# EasyEDA Pro project fan.eprj

# Schematic Schematic1
Create Date: 2022-11-01; Page Name: P1; Project Name: fan; Schematic Name: Schematic1; Update Date: 2022-11-12; Company: 嘉立创EDA; Page Size: A4; Version: V1.0
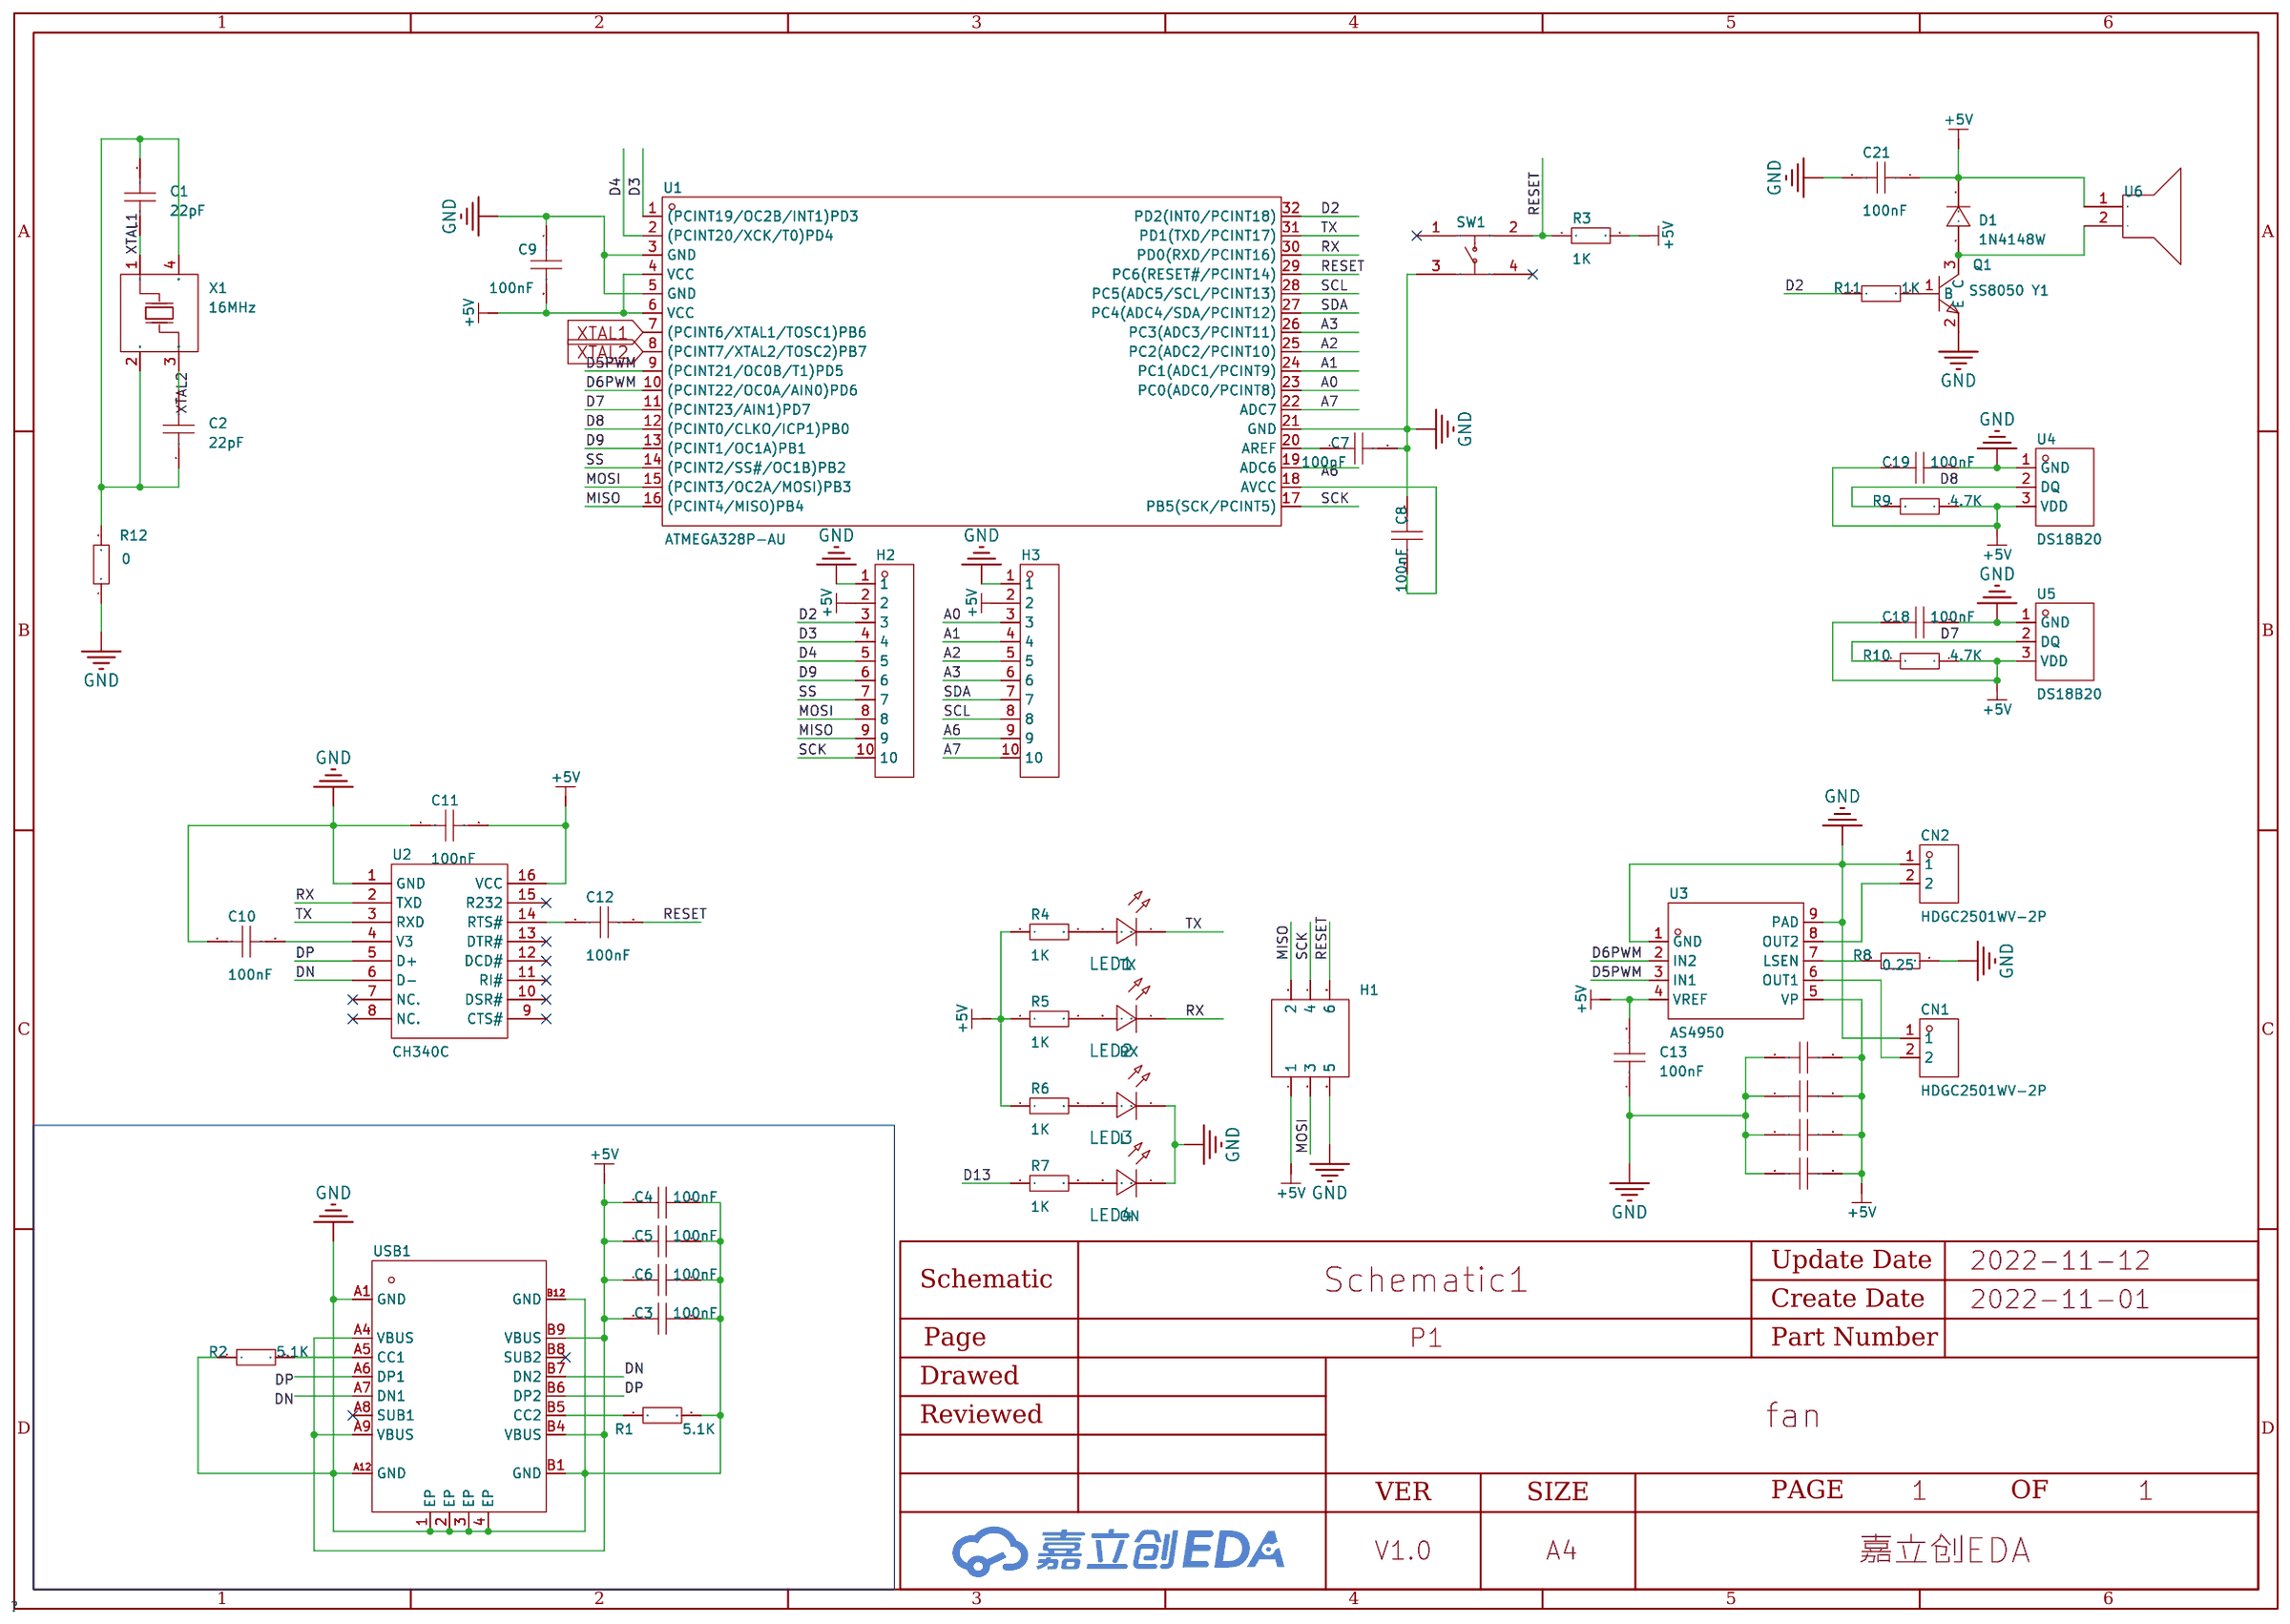
[diagram p0: schematic sheet]

## Parts
C1  100nF  [C0603]
C2  100nF  [C0603]
C3  100nF  [C0603]
C4  100nF  [C0603]
C5  100nF  [C0603]
C6  100nF  [C0603]
C7  100nF  [C0603]
C8  100nF  [C0603]
C9  100nF  [C0603]
C10  100nF  [C0603]
C11  100nF  [C0603]
C12  100nF  [C0603]
C13  100nF  [C0603]
C14  100nF  [C0603]
C15  100nF  [C0603]
C16  100nF  [C0603]
C17  100nF  [C0603]
C18  100nF  [C0603]
C19  100nF  [C0603]
C21  100nF  [C0603]
CN1  HDGC2501WV-2P  [CONN-TH_XH2.5-2P]
CN2  HDGC2501WV-2P  [CONN-TH_XH2.5-2P]
D1  1N4148W  [SOD-123_L2.8-W1.8-LS3.7-RD]
H1  -  [HDR-TH_6P-P2.54-V-R2-C3-S2.54_A2541WV-2X3P]
H2  -  [HDR-TH_10P-P2.54-V-F]
H3  -  [HDR-TH_10P-P2.54-V-F]
LED1  TX  [LED0603-RD_BLUE]
LED2  RX  [LED0603-RD_BLUE]
LED3  L  [LED0603-RD_BLUE]
LED4  ON  [LED0603-RD_BLUE]
Q1  SS8050 Y1  [SOT-23-3_L2.9-W1.3-P1.90-LS2.4-BR]
R1  10K  [R0603]
R2  10K  [R0603]
R3  10K  [R0603]
R4  10K  [R0603]
R5  10K  [R0603]
R6  10K  [R0603]
R7  10K  [R0603]
R8  10K  [R0603]
R9  10K  [R0603]
R10  10K  [R0603]
R11  10K  [R0603]
R12  10K  [R0603]
SW1  TSC015A03518A  [KEY-SMD_4P-L4.5-W4.5-P3.00-LS6.9]
U1  ATMEGA328P-AU  [TQFP-32_L7.0-W7.0-P0.80-LS9.0-BL]
U2  CH340C  [SOP-16_L10.0-W3.9-P1.27-LS6.0-BL]
U3  AS4950  [ESOP-8_L4.9-W3.9-P1.27-LS6.0-BL-EP]
U4  DS18B20  [TO-92-3_L4.9-W3.7-P1.27-L]
U5  DS18B20  [TO-92-3_L4.9-W3.7-P1.27-L]
U6  SFN-1270-0540-35P5.0  [BUZ-TH_BD12.5-P5.00-D0.9]
USB1  -  [USB-C-SMD_KH-TYPE-C-16P]
X1  16MHz  [CRYSTAL-SMD_4P-L3.2-W2.5-BL]

## Library data of the parts
C1-C19 C21 = CAP_0603: Supplier Footprint: 0603
CN1 CN2 = HDGC2501WV-2P: LCSC Part Name: XH2.5直针 2P; Supplier Part: C5175248; Manufacturer: HDGC(华德共创); Supplier Footprint: 直插,P=2.5mm; JLCPCB Part Class: Extended Part; Datasheet: https://atta.szlcsc.com/upload/public/pdf/source/20220916/EBD9616D8472D4916EA8DD7ED7929FB0.pdf; Supplier: LCSC
D1 = 1N4148W_C2099: 二极管配置:独立式;功率:500mW;直流反向耐压(Vr):100V;平均整流电流(Io):150mA;正向压降(Vf):1.25V@150mA;反向电流(Ir):1A@75V;反向恢复时间(trr):4ns;工作温度:+150@(Tj);; LCSC Part Name: 100V 150mA 4ns T4; Supplier Part: C2099; Manufacturer: CJ（江苏长电/长晶）; Supplier Footprint: SOD-123; JLCPCB Part Class: Extended Part; Datasheet: https://atta.szlcsc.com/upload/public/pdf/source/20120428/1457706480199.pdf; Supplier: LCSC; Diode Configuration: 独立式; Power Dissipation: 500mW; Reverse Voltage (Vr): 100V; Average Rectified Current (Io): 150mA; Forward Voltage (Vf@If): 1.25V@150mA; Reverse Leakage Current: 1A@75V; Reverse Recovery Time (trr): 4ns; Operating Temperature: +150@(Tj)
H1 = HDR-M_2.54_2x3: Supplier Part: C402781; Supplier Footprint: 插件,P=2.54mm
H2 H3 = HDR-F_2.54_1x10P: Supplier Part: C2684744; Supplier Footprint: 插件
LED1-LED4 = LED_0603-R: 发光颜色:红灯;二极管配置:-;透镜颜色:无色透明;主波长:617.5nm;峰值波长:632nm;色温:-;光通量(25时):-;测试电流:5mA;正向电压(VF):2.2V;发光强度:28.5mcd;功率:60mW;发光角度:120°;安装方式:-;工作温度:-40~+85;; Supplier Footprint: 0603; Supplier Part: C72044
Q1 = SS8050 Y1: LCSC Part Name: SS8050; Supplier Part: C2926167; Manufacturer: FOSAN(富信); Supplier Footprint: SOT-23; JLCPCB Part Class: Extended Part; Datasheet: https://atta.szlcsc.com/upload/public/pdf/source/20211203/A2FBB7B594BDA3797EAA8BDF93CA780E.pdf; Supplier: LCSC
R1-R12 = Res_0603: Supplier Footprint: 0603
SW1 = TSC015A03518A: 触点电流:50mA;额定电压(AC):12V;额定电压(DC):12V;安装方式:立贴;按钮形状:圆形按钮;开关长度:4.5mm;开关宽度:4.5mm;开关高度:3.5mm;; LCSC Part Name: 4.5*4.5*3.5H-JT 180gf; Supplier Part: C2888502; Manufacturer: BZCN(博众电气); Supplier Footprint: SMD; JLCPCB Part Class: Extended Part; Datasheet: https://atta.szlcsc.com/upload/public/pdf/source/20210826/40F8757B55672B65C18B583168747780.pdf; Supplier: LCSC; Contact Current: 50mA; Voltage Rating (AC): 12V; Voltage Rating (DC): 12V; Mounting Style: 立贴; Actuator Style: 圆形按钮; Switch Length: 4.5mm; Switch Width: 4.5mm; Switch Height: 3.5mm
U1 = ATMEGA328P-AU: ATmega Series 20 MHz 32 KB Flash 2 KB SRAM 8-Bit Microcontroller - TQFP-32; Supplier Part: C14877; Manufacturer: MICROCHIP(美国微芯); Supplier Footprint: TQFP-32_7x7x08P; JLCPCB Part Class: Basic Part; Datasheet: https://atta.szlcsc.com/upload/public/pdf/source/20140621/1457707095197.pdf; Supplier: LCSC
U2 = CH340C: 类型:Transceiver;协议类别:USB 2.0;驱动器/接收器数:-;数据速率:2Mbps;; Supplier Part: C84681; Manufacturer: WCH(南京沁恒); Supplier Footprint: SOP-16_150mil; JLCPCB Part Class: Extended Part; Datasheet: https://atta.szlcsc.com/upload/public/pdf/source/20200819/C84681_ADBED554CE321879DBD6B1D06488689C.pdf; Supplier: LCSC; Type: Transceiver; Protocol: USB 2.0; Data Rate: 2Mbps; Supply Voltage: 3.3V, 5V
U3 = AS4950: 全桥DMOS有刷直流电机驱动器，3.5A峰值驱动输出，8V-40V宽电压供电，支持过流/短路/欠压/过温保护; Supplier Part: C2929412; Manufacturer: ASSEMSTAR(聚迹); Supplier Footprint: SOP-8PP; JLCPCB Part Class: Extended Part; Datasheet: https://atta.szlcsc.com/upload/public/pdf/source/20211206/0EDB9C15312BCF5F7B0263298AF906FD.pdf; Supplier: LCSC
U4 U5 = DS18B20: 传感器类型:-;输出类型:-;局部感温:-;远程感温:-;分辨率:-;; Supplier Part: C376006; Manufacturer: UMW(友台半导体); Supplier Footprint: TO-92; JLCPCB Part Class: Extended Part; Datasheet: https://atta.szlcsc.com/upload/public/pdf/source/20220307/F147739DAED5754340FA7BABB64A1D8C.pdf; Supplier: LCSC
U6 = SFN-1270-0540-35P5.0: 驱动方式：无源(外部驱动) 构造类型：压电式 额定电压：5V 频率：4000Hz 声压(SPL)：80dB@5V,10cm 直径(φD)：12.6mm 高度：7.5mm; Supplier Part: C3015481; Manufacturer: S&S(海旭); Supplier Footprint: 插件,P=5mm; JLCPCB Part Class: Extended Part; Datasheet: https://atta.szlcsc.com/upload/public/pdf/source/20220517/E2F404692071743447D3DA4216E14D26.pdf; Supplier: LCSC
USB1 = USB_TYPE-C-16P: 连接器类型:Type-C;标准:-;公母:母座;触点数量:16;端口数量:1;安装方式:卧贴;额定电流 - 电源:3A;工作温度范围:-40~+85;; Supplier Part: C709357; Supplier Footprint: 插件
X1 = TAXM16M4RFBCCT2T: 晶振类型:SMD 谐振器;频率:16MHz;频率公差:±10ppm;频率稳定度:±50ppm;负载电容:12pF;等效串联电阻(ESR):80Ω;工作温度:-;; LCSC Part Name: 16MHz ±10ppm 12pF; Supplier Part: C133336; Manufacturer: TAE(雅晶鑫); Supplier Footprint: SMD3225-4P; JLCPCB Part Class: Extended Part; Datasheet: https://atta.szlcsc.com/upload/public/pdf/source/20171014/C133336_15079754975751038233.pdf; Supplier: LCSC; Crystal Type: SMD 谐振器; Frequency Tolerance: ±10ppm; Frequency Stability: ±50ppm; Load Capacitance: 12pF; Equivalent Series Resistance (ESR): 80Ω

## Nets
+5V: C3.1 C4.1 C5.1 C6.1 C9.2 C11.2 C13.2 C14.2 C15.2 C16.2 C17.2 C18.1 C19.1 C21.1 D1.1(K) H1.1 H2.2 H3.2 R3.2 R4.1 R5.1 R6.1 R9.1 R10.1 U1.4(VCC) U1.6(VCC) U2.16(VCC) U3.4(VREF) U3.5(VP) U4.3(VDD) U5.3(VDD) U6.1(+) USB1.A4(VBUS) USB1.A9(VBUS) USB1.B4(VBUS) USB1.B9(VBUS)
GND: C3.2 C4.2 C5.2 C6.2 C7.2 C8.2 C9.1 C10.1 C11.1 C13.1 C14.1 C15.1 C16.1 C17.1 C18.2 C19.2 C21.2 CN1.1 CN2.1 H1.5 H2.1 H3.1 LED3.1(C) LED4.1(C) Q1.2(E) R1.2 R2.1 R8.2 R12.1 SW1.3 U1.3(GND) U1.5(GND) U1.21(GND) U2.1(GND) U3.1(GND) U3.9(PAD) U4.1(GND) U5.1(GND) USB1.1(EP) USB1.2(EP) USB1.3(EP) USB1.4(EP) USB1.A1(GND) USB1.A12(GND) USB1.B1(GND) USB1.B12(GND)
A0: H3.3 U1.23(PC0(ADC0/PCINT8))
A1: H3.4 U1.24(PC1(ADC1/PCINT9))
A2: H3.5 U1.25(PC2(ADC2/PCINT10))
A3: H3.6 U1.26(PC3(ADC3/PCINT11))
A6: H3.9 U1.19(ADC6)
A7: H3.10 U1.22(ADC7)
D2: H2.3 R11.1 U1.32(PD2(INT0/PCINT18))
D3: H2.4 U1.1((PCINT19/OC2B/INT1)PD3)
D4: H2.5 U1.2((PCINT20/XCK/T0)PD4)
D5PWM: U1.9((PCINT21/OC0B/T1)PD5) U3.3(IN1)
D6PWM: U1.10((PCINT22/OC0A/AIN0)PD6) U3.2(IN2)
D7: R10.2 U1.11((PCINT23/AIN1)PD7) U5.2(DQ)
D8: R9.2 U1.12((PCINT0/CLKO/ICP1)PB0) U4.2(DQ)
D9: H2.6 U1.13((PCINT1/OC1A)PB1)
D13: R7.1
DN: U2.6(D-) USB1.A7(DN1) USB1.B7(DN2)
DP: U2.5(D+) USB1.A6(DP1) USB1.B6(DP2)
MISO: H1.2 H2.9 U1.16((PCINT4/MISO)PB4)
MOSI: H1.3 H2.8 U1.15((PCINT3/OC2A/MOSI)PB3)
RESET: C12.2 H1.6 R3.1 SW1.2 U1.29(PC6(RESET#/PCINT14))
RX: LED2.1(C) U1.30(PD0(RXD/PCINT16)) U2.2(TXD)
SCK: H1.4 H2.10 U1.17(PB5(SCK/PCINT5))
SCL: H3.8 U1.28(PC5(ADC5/SCL/PCINT13))
SDA: H3.7 U1.27(PC4(ADC4/SDA/PCINT12))
SS: H2.7 U1.14((PCINT2/SS#/OC1B)PB2)
TX: LED1.1(C) U1.31(PD1(TXD/PCINT17)) U2.3(RXD)
XTAL1: C1.1 U1.7((PCINT6/XTAL1/TOSC1)PB6) X1.1(OSC1)
XTAL2: C2.2 U1.8((PCINT7/XTAL2/TOSC2)PB7) X1.3(OSC2)
$1N27022: R2.2 USB1.A5(CC1)
$1N27208: R1.1 USB1.B5(CC2)
$1N32019: C7.1 U1.20(AREF)
$1N33833: C8.1 U1.18(AVCC)
$1N34726: C10.2 U2.4(V3)
$1N34859: C12.1 U2.14(RTS#)
$1N36273: LED1.2(A) R4.2
$1N36377: LED2.2(A) R5.2
$1N36480: LED3.2(A) R6.2
$1N36586: LED4.2(A) R7.2
$1N40110: R8.1 U3.7(LSEN)
$1N40463: CN2.2 U3.8(OUT2)
$1N40537: CN1.2 U3.6(OUT1)
$1N50250: D1.2(A) Q1.3(C) U6.2(-)
$1N50740: Q1.1(B) R11.2
$1N54622: C1.2 C2.1 R12.2 X1.2(GND) X1.4(GND)

Not connected (* = marked no-connect by the designer): SW1 1* 4*; U2 7(NC.)* 8(NC.)* 9(CTS#)* 10(DSR#)* 11(RI#)* 12(DCD#)* 13(DTR#)* 15(R232)*; USB1 A8(SUB1)* B8(SUB2)*

# Board PCB1
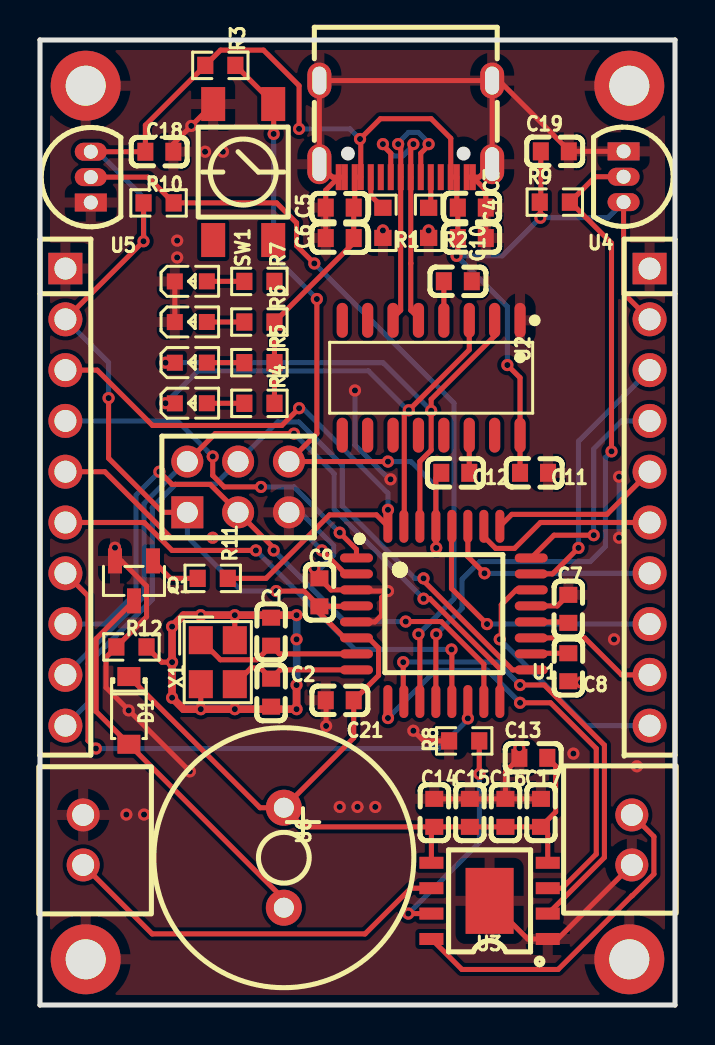
[diagram p1: board, top side]
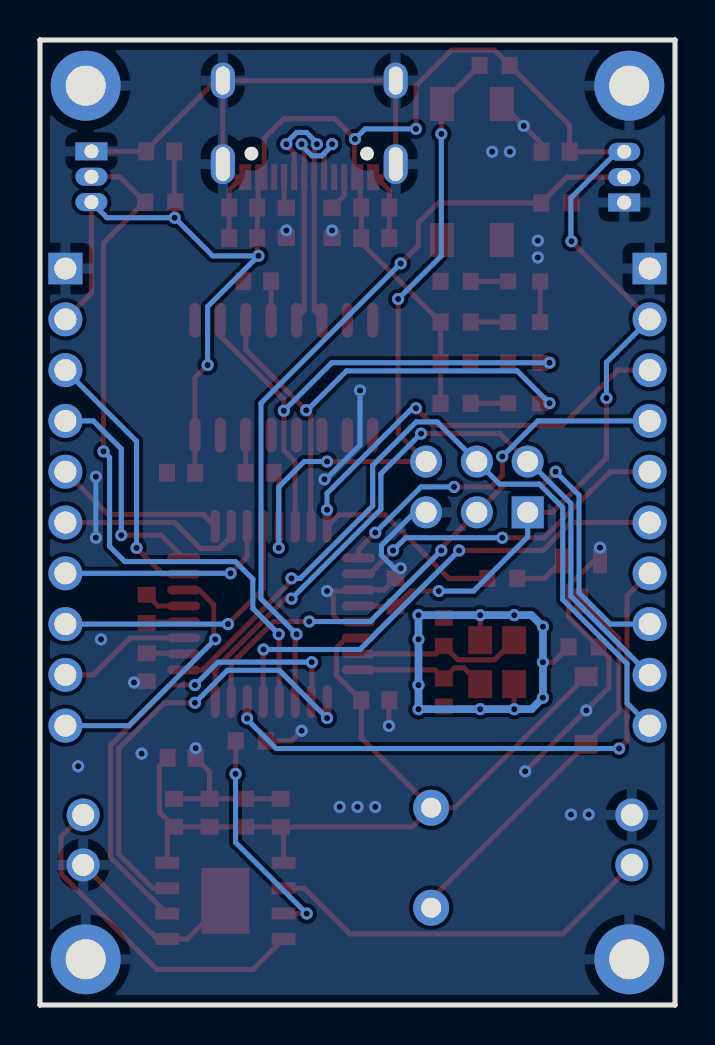
[diagram p2: board, bottom side, seen from below]

Outline 31.75 x 48.26 mm; copper layers: Top Layer, Bottom Layer. Coordinates in mm from the lower left corner of the outline.
Outline path: 0,48.26 0,0 arc(0,0) 0,0 31.75,0 arc(31.75,0) 31.75,0 31.75,48.26 arc(31.75,48.26) 31.75,48.26 0,48.26 arc(0,48.26) 0,48.26
Stack: Top Layer 0.035mm / Dielectric1 1.51mm FR4 er 4.5 / Bottom Layer 0.035mm

## Design rules (mm)
net TX: DP1
net RX: DP1
net MISO: DP3
net SCK: DP3
net SCL: DP4
net SDA: DP4
net A3: DP5
net A2: DP5
net D6PWM: DP2
net D5PWM: DP2
net D4: DP6
net D3: DP6
spacing safeClearance (default): track to track 0.152, other pairs 0.152 to 0.3
track width trackWidth (default): min 0.127, default 0.254, max 2.54
differential pair differentialPair (default): width min 0.127, default 0.254, max 2.54; gap min 0.152, default 0.152
via viaSize (default): diameter min 0.5, default 0.61, max 10; hole min 0.3, default 0.305, max 6

## Placement (name value [footprint] x y rotation side)
C1  100nF  [C0603]  11.56 18.67 90 top
C2  100nF  [C0603]  11.56 15.62 90 top
C3  100nF  [C0603]  21.59 39.88 0 top
C4  100nF  [C0603]  21.59 38.35 0 top
C5  100nF  [C0603]  14.99 39.88 180 top
C6  100nF  [C0603]  14.99 38.35 180 top
C7  100nF  [C0603]  26.42 19.81 90 top
C8  100nF  [C0603]  26.42 16.89 270 top
C9  100nF  [C0603]  13.97 20.64 270 top
C10  100nF  [C0603]  20.89 36.19 180 top
C11  100nF  [C0603]  24.7 26.61 180 top
C12  100nF  [C0603]  20.76 26.61 180 top
C13  100nF  [C0603]  24.67 12.36 0 top
C14  100nF  [C0603]  19.71 9.61 270 top
C15  100nF  [C0603]  21.49 9.61 270 top
C16  100nF  [C0603]  23.27 9.61 270 top
C17  100nF  [C0603]  25.05 9.61 270 top
C18  100nF  [C0603]  5.97 42.67 0 top
C19  100nF  [C0603]  25.74 42.69 0 top
C21  100nF  [C0603]  14.99 15.24 180 top
CN1  HDGC2501WV-2P  [CONN-TH_XH2.5-2P]  2.16 8.25 270 top
CN2  HDGC2501WV-2P  [CONN-TH_XH2.5-2P]  29.59 8.25 90 top
D1  1N4148W  [SOD-123_L2.8-W1.8-LS3.7-RD]  4.44 14.73 270 top
H1  -  [HDR-TH_6P-P2.54-V-R2-C3-S2.54_A2541WV-2X3P]  9.91 25.91 0 top
H2  -  [HDR-TH_10P-P2.54-V-F]  1.27 25.4 270 top
H3  -  [HDR-TH_10P-P2.54-V-F]  30.48 25.4 270 top
LED1  TX  [LED0603-RD_BLUE]  7.54 30.09 0 top
LED2  RX  [LED0603-RD_BLUE]  7.54 32.12 0 top
LED3  L  [LED0603-RD_BLUE]  7.54 34.15 0 top
LED4  ON  [LED0603-RD_BLUE]  7.54 36.19 0 top
NOREF  -  [Pad_e6]  2.29 45.97 0 top
NOREF#2  -  [Pad_e10]  29.46 45.97 0 top
NOREF#3  -  [Pad_e11]  2.29 2.29 0 top
NOREF#4  -  [Pad_e12]  29.46 2.29 0 top
Q1  SS8050 Y1  [SOT-23-3_L2.9-W1.3-P1.90-LS2.4-BR]  4.7 21.21 90 top
R1  10K  [R0603]  17.15 39.12 270 top
R2  10K  [R0603]  19.43 39.12 90 top
R3  10K  [R0603]  9.02 46.99 180 top
R4  10K  [R0603]  10.97 30.09 180 top
R5  10K  [R0603]  10.97 32.12 180 top
R6  10K  [R0603]  10.97 34.15 180 top
R7  10K  [R0603]  10.97 36.19 180 top
R8  10K  [R0603]  21.21 13.21 180 top
R9  10K  [R0603]  25.74 40.15 0 top
R10  10K  [R0603]  5.93 40.11 0 top
R11  10K  [R0603]  8.64 21.34 180 top
R12  10K  [R0603]  4.57 17.91 0 top
SW1  TSC015A03518A  [KEY-SMD_4P-L4.5-W4.5-P3.00-LS6.9]  10.16 41.66 90 top
U1  ATMEGA328P-AU  [TQFP-32_L7.0-W7.0-P0.80-LS9.0-BL]  20.19 19.56 270 top
U2  CH340C  [SOP-16_L10.0-W3.9-P1.27-LS6.0-BL]  19.56 31.37 180 top
U3  AS4950  [ESOP-8_L4.9-W3.9-P1.27-LS6.0-BL-EP]  22.48 5.21 90 top
U4  DS18B20  [TO-92-3_L4.9-W3.7-P1.27-L]  29.18 41.42 270 top
U5  DS18B20  [TO-92-3_L4.9-W3.7-P1.27-L]  2.54 41.4 90 top
U6  SFN-1270-0540-35P5.0  [BUZ-TH_BD12.5-P5.00-D0.9]  12.19 7.37 270 top
USB1  -  [USB-C-SMD_KH-TYPE-C-16P]  18.29 43.81 180 top
X1  16MHz  [CRYSTAL-SMD_4P-L3.2-W2.5-BL]  8.89 17.14 270 top

## Footprints (pads in the part's own frame, mm; a bottom-side part is the same pattern mirrored in y, then rotated)
BUZ-TH_BD12.5-P5.00-D0.9
  round 1.8 hole 1: 1(-2.5,0) 2(2.5,0)
C0603
  rect 0.8x0.9 smd: 1(-0.7,0) 2(0.7,0)
CONN-TH_XH2.5-2P
  round 1.65 hole 1.1: 1(-1.25,0) 2(1.25,0)
CRYSTAL-SMD_4P-L3.2-W2.5-BL
  rect 1.4x1.2 smd: 1(-1.1,-0.85) 2(1.1,-0.85) 3(1.1,0.85) 4(-1.1,0.85)
ESOP-8_L4.9-W3.9-P1.27-LS6.0-BL-EP
  rect 0.6x1.2 smd: 1(-1.905,-2.909) 2(-0.635,-2.909) 3(0.635,-2.909) 4(1.905,-2.909) 5(1.905,2.909) 6(0.635,2.909) 7(-0.635,2.909) 8(-1.905,2.909)
  rect 3.3x2.4 smd: 9(0,0)
HDR-TH_6P-P2.54-V-R2-C3-S2.54_A2541WV-2X3P
  rect 1.6x1.6 hole 1.05: 1(-2.54,-1.27)
  round 1.6 hole 1.05: 2(-2.54,1.27) 3(0,-1.27) 4(0,1.27) 5(2.54,-1.27) 6(2.54,1.27)
HDR-TH_10P-P2.54-V-F
  rect 1.575x1.7 hole 1.1: 1(-11.43,0)
  round 1.7 hole 1.1: 2(-8.89,0) 3(-6.35,0) 4(-3.81,0) 5(-1.27,0) 6(1.27,0) 7(3.81,0) 8(6.35,0) 9(8.89,0) 10(11.43,0)
KEY-SMD_4P-L4.5-W4.5-P3.00-LS6.9
  rect 1.7x1.199 smd: 1(-3.401,-1.501) 2(3.401,-1.501) 3(3.401,1.501) 4(-3.401,1.501)
LED0603-RD_BLUE
  rect 0.8x0.8 smd: 1(-0.8,-0.003) 2(0.8,0.003)
Pad_e6
  round 3.5 hole 2: 1(0,0)
Pad_e10
  round 3.5 hole 2: 2(0,0)
Pad_e11
  round 3.5 hole 2: 3(0,0)
Pad_e12
  round 3.5 hole 2: 6(0,0)
R0603
  rect 0.806x0.864 smd: 1(-0.753,0) 2(0.753,0)
SOD-123_L2.8-W1.8-LS3.7-RD
  rect 0.95x1.15 smd: 1(-1.692,0) 2(1.692,0)
SOP-16_L10.0-W3.9-P1.27-LS6.0-BL
  oval 0.56x1.745 smd: 1(-4.445,-2.873) 2(-3.175,-2.873) 3(-1.905,-2.873) 4(-0.635,-2.873) 5(0.635,-2.873) 6(1.905,-2.873) 7(3.175,-2.873) 8(4.445,-2.873) 9(4.445,2.873) 10(3.175,2.873) 11(1.905,2.873) 12(0.635,2.873) 13(-0.635,2.873) 14(-1.905,2.873) 15(-3.175,2.873) 16(-4.445,2.873)
SOT-23-3_L2.9-W1.3-P1.90-LS2.4-BR
  rect 1.25x0.7 smd: 1(1,-0.95) 2(1,0.95) 3(-1,0)
TO-92-3_L4.9-W3.7-P1.27-L
  rect 0.9x1.6 hole 0.7: 1(-1.27,0)
  oval 0.9x1.6 hole 0.7: 2(0,0) 3(1.27,0)
TQFP-32_L7.0-W7.0-P0.80-LS9.0-BL
  oval 0.45x1.65 smd: 1(-2.8,-4.369) 2(-2,-4.369) 3(-1.2,-4.369) 4(-0.4,-4.369) 5(0.4,-4.369) 6(1.2,-4.369) 7(2,-4.369) 8(2.8,-4.369) 17(2.8,4.369) 18(2,4.369) 19(1.2,4.369) 20(0.4,4.369) 21(-0.4,4.369) 22(-1.2,4.369) 23(-2,4.369) 24(-2.8,4.369)
  oval 1.65x0.45 smd: 9(4.381,-2.8) 10(4.381,-2) 11(4.381,-1.2) 12(4.381,-0.4) 13(4.381,0.4) 14(4.381,1.2) 15(4.381,2) 16(4.381,2.8) 25(-4.381,2.8) 26(-4.381,2) 27(-4.381,1.2) 28(-4.381,0.4) 29(-4.381,-0.4) 30(-4.381,-1.2) 31(-4.381,-2) 32(-4.381,-2.8)
USB-C-SMD_KH-TYPE-C-16P
  oval 1.2x2 hole 0.7x1.7: 1(-4.32,1.765) 2(4.32,1.765)
  oval 1.2x1.8 hole 0.7x1.4: 3(-4.32,-2.415) 4(4.32,-2.415)
  rect 0.3x1.3 smd: A1(-3.35,2.415) A4(-2.55,2.415) A5(-1.25,2.415) A6(-0.25,2.415) A7(0.25,2.415) A8(1.25,2.415) A9(2.55,2.415) A12(3.35,2.415) B1(3.05,2.415) B4(2.25,2.415) B5(1.75,2.415) B6(0.75,2.415) B7(-0.75,2.415) B8(-1.75,2.415) B9(-2.25,2.415) B12(-3.05,2.415)

## Nets
As in the schematic, except:
GND: C3.2 C4.2 C5.2 C6.2 C7.2 C8.2 C9.1 C10.1 C11.1 C13.1 C14.1 C15.1 C16.1 C17.1 C18.2 C19.2 C21.2 CN1.1 CN2.1 H1.5 H2.1 H3.1 LED3.1 LED4.1 NOREF.1 NOREF#2.2 NOREF#3.3 NOREF#4.6 Q1.2 R1.2 R2.1 R8.2 R12.1 SW1.3 U1.3 U1.5 U1.21 U2.1 U3.1 U3.9 U4.1 U5.1 USB1.1 USB1.2 USB1.3 USB1.4 USB1.A1 USB1.A12 USB1.B1 USB1.B12

Pads without a net: SW1 1 4; U2 7 8 9 10 11 12 13 15; USB1 A8 B8

## Via types
v1: diameter 0.61, hole 0.305, Top Layer to Bottom Layer, 91 vias

## Routing (per net, layer and track width the routed paths; a pad name or vN(x,y) marks a point on that pad's centre or on a via; arc(x,y) is an arc through that point)
+5V: length 160.3
  Top Layer w0.254: C9.2 13.21,20.7 v1(11.81,20.7) ; C9.2 13.97,19.61 15.22,18.36 U1.6 16.42,18.36 16.93,17.85 16.93,16.48 15.69,15.24 15.69,13.36 U6.1 ; C9.2 13.97,19.94 15.81,19.94 U1.4 ; U4.3 29.18,35.59 H3.2 ; v1(3.43,30.35) 3.43,27.34 6.13,24.64 H1.1 ; C17.2 25.05,8.92 25.78,9.65 25.78,11.95 C13.2 ; C17.2 25.39,8.57 U3.4 ; C17.2 C16.2 C15.2 C14.2 ; C14.2 19.57,8.77 U3.5 ; C14.2 13.15,8.91 U6.1 ; v1(25.02,39.37) 25.02,40.12 R9.1 25.04,40.2 C19.1 ; v1(20.83,37.46) 20.89,37.53 C4.1 C3.1 20.84,39.93 USB1.A4 USB1.B9 20.54,43.34 19.56,44.32 17.02,44.32 16.04,43.34 USB1.B4 USB1.A9 15.74,39.93 15.69,39.88 15.69,38.12 R6.1 R5.1 R4.1 ; D1.1 11,9.87 U6.1 ; U5.3 C18.1 5.27,44 R3.2 9.03,47.75 11.18,47.75 12.95,45.97 v1(12.95,43.81) ; v1(23.37,32) 24,31.37 U2.16 24,26.62 ; H2.2 v1(5.18,38.2) R10.1
  Bottom Layer w0.254: v1(11.81,20.7) 10.07,20.7 7.37,23.41 H1.1 ; v1(3.43,30.35) 3.43,32.13 H2.2 ; v1(12.95,43.81) 15.49,43.81 v1(16,43.31) ; v1(23.37,32) 23.37,34.92 v1(20.83,37.46) 23.11,37.46 v1(25.02,39.37) 28.4,39.37 U4.3 ; v1(5.18,38.2) 5.21,38.23 5.21,40.35 2.89,42.67 U5.3
GND: length 97.3
  Top Layer w0.254: v1(18.67,13.72) 19.18,13.21 R8.2 ; USB1.B12 USB1.A1 ; USB1.A1 21.96,41.4 USB1.1 USB1.3 ; USB1.A1 22.29,40.75 C3.2 C4.2 ; USB1.A12 14.62,41.4 13.97,42.05 13.97,46.23 USB1.3 ; USB1.A12 14.29,40.75 C5.2 C6.2 ; USB1.A12 USB1.B1 ; 15.68,20.76 15.74,20.7 v1(17.4,20.7) 17.08,20.38 17.08,19.49 16.75,19.16 U1.5 ; 15.68,20.76 U1.3 ; 15.68,20.76 14.55,20.76 C9.1 13.97,21.59 v1(13.72,21.84) ; USB1.3 22.61,46.23 22.95,46.23 26.44,42.74 C19.2 U4.1 ; C21.2 14.31,15.22 v1(14.31,13.96) ; v1(7.49,11.68) 4.44,14.73 v1(4.44,14.73) 4.44,14.74 3.3,15.87 3.3,17.39 R12.1 5.33,19.42 5.33,20.95 4.07,22.21 Q1.2 ; C7.2 25.86,19.96 U1.21 ; C18.2 6.67,43.07 v1(7.56,43.96) SW1.3 ; C16.1 23.27,11.66 C13.1 ; C16.1 C17.1 ; C16.1 C15.1 C14.1 ; v1(17.15,38.73) R1.2 ; LED3.1 LED4.1 ; CN2.1 25.89,3.3 U3.1 24.38,3.3 U3.9 ; R2.1 v1(19.43,38.73)
  Bottom Layer w0.254: v1(17.53,26.29) 17.46,26.29 15.75,28 v1(15.75,30.73) ; v1(13.72,21.84) 14.03,21.84 14.68,22.49 14.68,22.97 13.02,24.64 H1.5 ; v1(28.96,26.42) v1(28.96,23.37)
  vias: v1(3.75,22.87) v1(4.32,9.52) v1(5.2,9.52) v1(6.86,38.23) v1(6.86,37.38) v1(8.25,42.67) v1(9.14,42.67) v1(14.99,9.91) v1(15.88,9.91) v1(16.76,9.91) v1(23.97,12.84) v1(26.67,12.57) v1(27.05,16.13) v1(28.7,18.29) v1(29.84,11.94)
A0: length 13.3
  Top Layer w0.254: U1.23 25.62,21.56 v1(26.92,22.86)
  Bottom Layer w0.254: H3.3 26.92,28.19 v1(26.92,22.86)
A1: length 11.3
  Top Layer w0.254: v1(27.69,23.49) 25.7,23.49 U1.24
  Bottom Layer w0.254: H3.4 29.08,29.21 27.69,27.81 v1(27.69,23.49)
A2: length 8.6
  Top Layer w0.254: U1.25 23.59,24.54 28.35,24.54 H3.5
A3: length 9.6
  Top Layer w0.254: U1.26 22.19,23.43 22.78,22.83 23.73,22.83 25.02,24.13 H3.6
A6: length 6.7
  Top Layer w0.254: H3.9 29.08,16.51 27.24,18.36 U1.19
A7: length 12.8
  Top Layer w0.254: U1.22 23.81,20.76 23.06,20.02 23.06,18.36 v1(22.99,18.29)
  Bottom Layer w0.254: v1(22.99,18.29) 27.31,13.97 H3.10
D2: length 30.6
  Top Layer w0.254: v1(17.4,24.76) 17.4,23.95 U1.32 16.82,24.51 14.48,24.51 11.3,21.34 R11.1 ; H2.3 2.86,31.75 5.63,28.98 12.09,28.98 v1(12.95,29.84)
  Bottom Layer w0.254: v1(17.4,24.76) 17.4,25.59 13.14,29.84 v1(12.95,29.84)
D3: length 18.2
  Top Layer w0.254: U1.1 15.82,22.78 v1(14.99,23.62) ; v1(11.05,25.91) 9.21,25.91 8.64,26.48 v1(8.64,27.43)
  Bottom Layer w0.254: v1(8.64,27.43) 6.86,29.21 H2.4 ; v1(14.99,23.62) 12.7,25.91 v1(11.05,25.91)
D4: length 16.7
  Top Layer w0.254: U1.2 15.27,21.56 v1(14.1,22.73) ; H2.5 3.24,26.67 6.54,23.37 v1(8.64,23.37)
  Bottom Layer w0.254: v1(8.64,23.37) 13.46,23.37 v1(14.1,22.73)
D5PWM: length 22.3
  Top Layer w0.254: U1.9 17.4,15.17 v1(17.4,14.35) ; U3.3 26.11,5.84 27.81,7.55 27.81,12.83 25.53,15.11 v1(24,15.11)
  Bottom Layer w0.254: v1(17.4,14.35) 19.79,16.74 22.38,16.74 v1(24,15.11)
D6PWM: length 23.4
  Top Layer w0.254: U3.2 25.41,4.57 28.22,7.38 28.22,13 25.21,16 v1(24,16) ; v1(18.16,17.14) 18.16,15.21 U1.10
  Bottom Layer w0.254: v1(24,16) 22.86,17.14 v1(18.16,17.14)
D7: length 39.2
  Top Layer w0.254: v1(13.72,37.08) 12.83,37.97 12.83,39.12 11.83,40.11 R10.2 5.39,41.4 U5.2 ; U1.11 18.99,18.47 v1(18.92,18.54)
  Bottom Layer w0.254: v1(18.92,18.54) 20.7,20.32 20.7,30.1 v1(13.72,37.08)
D8: length 35.9
  Top Layer w0.254: U4.2 27.76,41.42 R9.2 26.52,40.15 28.57,38.1 v1(28.57,27.69) ; U1.12 19.79,18.52 v1(19.81,18.54)
  Bottom Layer w0.254: v1(19.81,18.54) 21.11,19.84 21.11,21.3 21.98,22.17 27.51,22.17 28.27,22.94 28.27,27.38 v1(28.57,27.69)
D9: length 24.5
  Top Layer w0.254: v1(20.57,17.78) 20.59,17.76 U1.13 ; v1(10.79,22.73) 6.6,22.73 5.21,24.13 H2.6
  Bottom Layer w0.254: v1(20.57,17.78) 15.75,17.78 v1(10.79,22.73)
DN: length 12.8
  Top Layer w0.254: v1(17.91,43.05) 18.04,42.92 USB1.A7 18.03,41.4 18.03,34.74 17.65,34.36 ; USB1.B7 19.04,42.6 19.43,42.99 v1(19.43,43.05)
  Bottom Layer w0.254: v1(17.91,43.05) 17.91,43.12 18.43,43.64 18.91,43.64 19.43,43.12 v1(19.43,43.05)
DP: length 12.8
  Top Layer w0.254: 18.54,37.09 18.54,34.74 18.92,34.36 ; 18.54,37.09 18.54,37.08 ; 18.54,37.09 USB1.A6 18.54,42.92 v1(18.67,43.05) ; v1(17.15,43.05) 17.15,42.99 17.54,42.6 USB1.B6
  Bottom Layer w0.254: v1(18.67,43.05) 18.67,42.99 18.15,42.47 17.66,42.47 17.15,42.99 v1(17.15,43.05)
MISO: length 37
  Top Layer w0.254: v1(19.18,20.32) 19.49,20.32 22.99,16.82 U1.16 ; v1(12.7,28.57) 8.76,28.57 H1.2
  Bottom Layer w0.254: H2.9 5.21,20.45 5.21,25.08 7.3,27.18 H1.2 ; v1(12.7,28.57) 14.71,26.57 14.71,24.79 v1(19.18,20.32)
MOSI: length 32.9
  Top Layer w0.254: v1(11.68,22.73) 11.68,22.86 H1.3 8.51,26.03 6.6,26.03 v1(5.97,26.67) ; U1.15 22.19,17.04 20.06,19.18 v1(18.29,19.18)
  Bottom Layer w0.254: v1(11.68,22.73) 15.24,19.18 v1(18.29,19.18) ; v1(5.97,26.67) 4.8,25.5 4.8,20.62 3.24,19.05 H2.8
RESET: length 36.9
  Top Layer w0.254: v1(11.68,43.56) 11.68,45.03 SW1.2 11.66,45.1 R3.1 ; C12.2 19.79,26.34 U1.29 19.79,22.88 v1(19.81,22.86) ; v1(13.84,35.31) 13.84,28.57 H1.6 v1(17.4,27.18)
  Bottom Layer w0.254: v1(11.68,43.56) 11.68,37.46 v1(13.84,35.31) ; v1(17.4,27.18) 18.54,27.18 19.81,25.91 v1(19.81,22.86)
RX: length 26.1
  Top Layer w0.254: U2.2 22.73,33.46 19.56,30.29 v1(19.56,29.72) 19.56,27.75 18.99,27.18 U1.30
  Bottom Layer w0.254: v1(6.27,32.12) 17.16,32.12 v1(19.56,29.72)
SCK: length 39.8
  Top Layer w0.254: v1(19.18,21.34) 19.18,21.21 23.63,16.76 U1.17
  Bottom Layer w0.254: v1(19.18,21.34) 18.74,21.34 15.11,24.96 15.11,26.99 12.94,29.16 11.89,29.16 H1.4 8.78,26.05 6.78,26.05 5.61,24.88 5.61,20.28 2.4,17.06 2.4,15.1 H2.10
SCL: length 13.8
  Top Layer w0.254: U1.28 20.57,23.92 20.57,20.83 v1(22.35,19.05)
  Bottom Layer w0.254: v1(22.35,19.05) H3.8
SDA: length 10.9
  Top Layer w0.254: U1.27 21.39,22.42 v1(22.22,21.59)
  Bottom Layer w0.254: v1(22.22,21.59) H3.7
SS: length 28.6
  Top Layer w0.254: H2.7 2.4,20.46 2.4,13.22 v1(2.79,12.83)
  Bottom Layer w0.254: v1(21.39,14.33) 21.39,14.28 19.94,12.83 v1(2.79,12.83)
TX: length 25.3
  Top Layer w0.254: U1.31 18.21,23.96 18.21,29.52 v1(18.44,29.74) 21.46,32.77 U2.3
  Bottom Layer w0.254: v1(6.27,30.1) 7.89,31.71 16.42,31.71 18.39,29.74 v1(18.44,29.74)
XTAL1: length 8.5
  Top Layer w0.254: X1.1 9.02,17.27 10.85,17.27 C1.1 11.97,17.56 15.7,17.56
XTAL2: length 6.7
  Top Layer w0.254: 15.7,16.76 12,16.76 C2.2 11.02,16.86 10.55,16.86 9.74,16.04
$1N27022: length 1.6
  Top Layer w0.254: USB1.A5 19.54,39.98 R2.2
$1N27208: length 1.8
  Top Layer w0.254: R1.1 16.54,40.48 USB1.B5
$1N32019: length 1.9
  Top Layer w0.254: U1.20 26.37,19.16 C7.1
$1N33833: length 1.9
  Top Layer w0.254: U1.18 24.59,17.59 C8.1
$1N34726: length 2
  Top Layer w0.254: 20.19,36.19 U2.4
$1N34859: length 1.9
  Top Layer w0.254: U2.14 21.46,26.62
$1N36273: length 1.9
  Top Layer w0.254: LED1.2 10.21,30.09 R4.2
$1N36377: length 1.9
  Top Layer w0.254: LED2.2 10.21,32.13 R5.2
$1N36480: length 1.9
  Top Layer w0.254: R6.2 10.21,34.16 LED3.2
$1N36586: length 1.9
  Top Layer w0.254: R7.2 10.21,36.19 LED4.2
$1N40110: length 11.3
  Top Layer w0.254: v1(18.41,4.57) U3.7 ; R8.1 21.96,11.57 v1(21.97,11.56)
  Bottom Layer w0.254: v1(18.41,4.57) 21.97,8.13 v1(21.97,11.56)
$1N40463: length 17.2
  Top Layer w0.254: CN2.2 29.61,9.5 30.7,8.42 30.7,6.55 29.61,5.46 29.59,5.46 25.91,1.78 21.09,1.78 U3.8
$1N40537: length 19.8
  Top Layer w0.254: CN1.2 5.61,3.56 16.25,3.56 18.54,5.84 U3.6
$1N50250: length 20
  Top Layer w0.254: U6.2 12.19,5.29 D1.2 2.81,14.68 2.81,18.32 Q1.3
$1N50740: length 2.6
  Top Layer w0.254: Q1.1 6.52,21.34 R11.2
$1N54622: length 43.1
  Top Layer w0.254: v1(6.6,17.14) 6.09,17.14 R12.2 ; 8.04,16.04 8.04,14.92 ; v1(9.74,19.5) X1.4
  Top Layer w0.381: v1(12.83,16) v1(12.83,14.79) 11.68,14.79 C2.1 11.43,14.79 v1(9.74,14.79) 9.68,14.73 ; 9.68,14.79 7.18,14.79 v1(6.6,15.37) v1(6.6,17.14) v1(6.6,18.92) 7.18,19.5 v1(8.04,19.5) v1(9.74,19.5) 11.43,19.5 11.56,19.37 11.68,19.5 v1(12.83,19.5)
  Bottom Layer w0.381: v1(9.74,19.5) v1(8.04,19.5) 7.18,19.5 v1(6.6,18.92) v1(6.6,17.14) v1(6.6,15.37) 7.18,14.79 v1(8.04,14.79) 9.74,14.79 ; 9.74,19.5 v1(12.83,19.5) v1(12.83,18.29) v1(12.83,16) v1(12.83,14.79) v1(9.74,14.79)

## Copper pours and planes (outline as drawn; the poured copper is in the pictures)
GND on Top Layer: -0.13,48.51 -0.13,-0.38 31.75,-0.38 31.88,-0.25 31.88,48.51
GND on Bottom Layer: -0.13,48.64 -0.13,0 31.88,0 31.88,48.64

Small or netless copper shapes (teardrops, artwork), in the pictures only: 1 on Top Layer, 1 on Bottom Layer

## Text on the board
Top Silkscreen Layer: +
